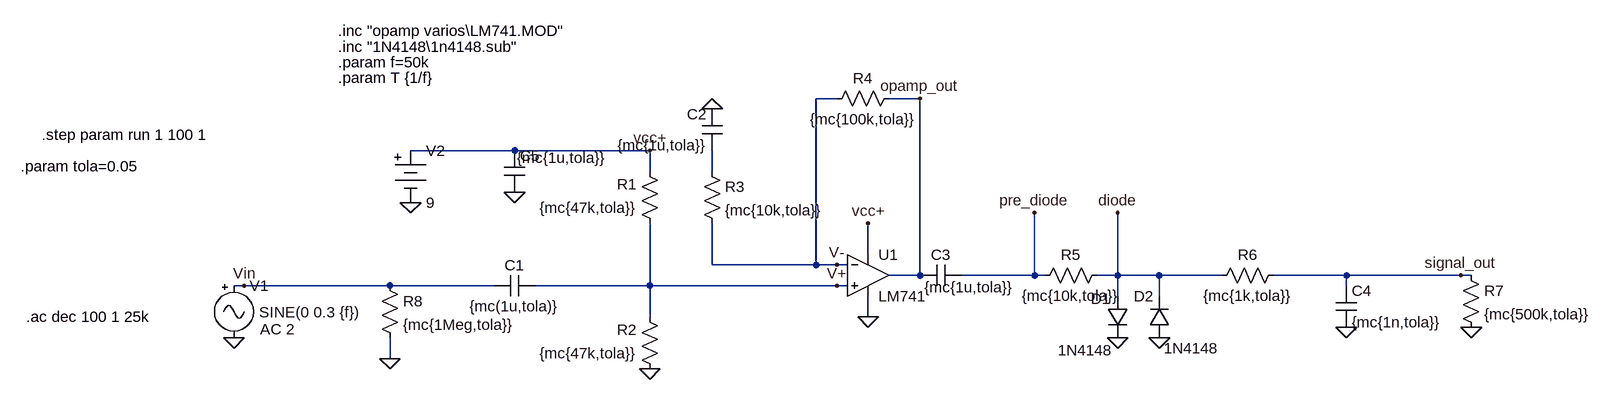
[diagram p0: schematic punto 5 montecarlo.asc]
punto 5 montecarlo.asc, the LTspice schematic file:
Version 4
SHEET 1 1692 680
WIRE 208 -160 176 -160
WIRE 336 -160 288 -160
WIRE -288 -80 -448 -80
WIRE -80 -80 -288 -80
WIRE -80 -48 -80 -80
WIRE 16 -48 16 -80
WIRE 256 80 256 32
WIRE 16 96 16 32
WIRE 176 96 176 -160
WIRE 176 96 16 96
WIRE 208 96 176 96
WIRE 224 96 208 96
WIRE 336 112 336 -160
WIRE 336 112 288 112
WIRE 512 112 512 16
WIRE 512 112 400 112
WIRE 528 112 512 112
WIRE 640 112 640 16
WIRE 640 112 608 112
WIRE 704 112 640 112
WIRE 800 112 704 112
WIRE 992 112 880 112
WIRE 1168 112 992 112
WIRE 1184 112 1168 112
WIRE -704 128 -720 128
WIRE -480 128 -704 128
WIRE -320 128 -480 128
WIRE -80 128 -80 32
WIRE -80 128 -256 128
WIRE 208 128 -80 128
WIRE 224 128 208 128
WIRE 992 128 992 112
WIRE 640 144 640 112
WIRE 704 144 704 112
WIRE -80 176 -80 128
WIRE 256 176 256 144
WIRE -480 240 -480 208
FLAG 208 128 V+
FLAG 208 96 V-
FLAG 16 -144 0
FLAG 640 208 0
FLAG 704 208 0
FLAG 992 192 0
FLAG 256 176 0
FLAG -80 256 0
FLAG 1184 192 0
FLAG -288 -16 0
FLAG -480 240 0
FLAG -720 208 0
FLAG -448 0 0
FLAG 1168 112 signal_out
FLAG -704 128 Vin
FLAG -80 -80 vcc+
FLAG 256 32 vcc+
FLAG 336 -160 opamp_out
FLAG 640 16 diode
FLAG 512 16 pre_diode
DATAFLAG -224 -80 ""
DATAFLAG -80 112 ""
SYMBOL res -64 48 R180
WINDOW 0 36 76 Left 2
WINDOW 3 36 40 Left 2
SYMATTR InstName R1
SYMATTR Value {mc{47k,tola}}
SYMBOL res -64 272 R180
WINDOW 0 36 76 Left 2
WINDOW 3 36 40 Left 2
SYMATTR InstName R2
SYMATTR Value {mc{47k,tola}}
SYMBOL res 0 -64 R0
SYMATTR InstName R3
SYMATTR Value {mc{10k,tola}}
SYMBOL res 304 -176 R90
WINDOW 0 0 56 VBottom 2
WINDOW 3 32 56 VTop 2
SYMATTR InstName R4
SYMATTR Value {mc{100k,tola}}
SYMBOL res 624 96 R90
WINDOW 0 0 56 VBottom 2
WINDOW 3 32 56 VTop 2
SYMATTR InstName R5
SYMATTR Value {mc{10k,tola}}
SYMBOL cap -256 112 R90
WINDOW 0 0 32 VBottom 2
WINDOW 3 32 32 VTop 2
SYMATTR InstName C1
SYMATTR Value {mc(1u,tola)}
SYMBOL cap 32 -80 R180
WINDOW 0 24 56 Left 2
WINDOW 3 24 8 Left 2
SYMATTR InstName C2
SYMATTR Value {mc{1u,tola}}
SYMBOL cap 336 128 R270
WINDOW 0 32 32 VTop 2
WINDOW 3 13 76 VBottom 2
SYMATTR InstName C3
SYMATTR Value {mc{1u,tola}}
SYMBOL res 896 96 R90
WINDOW 0 0 56 VBottom 2
WINDOW 3 32 56 VTop 2
SYMATTR InstName R6
SYMATTR Value {mc{1k,tola}}
SYMBOL cap 976 128 R0
SYMATTR InstName C4
SYMATTR Value {mc{1n,tola}}
SYMBOL diode 624 144 R0
WINDOW 0 -25 4 Left 2
WINDOW 3 87 80 Left 2
SYMATTR InstName D1
SYMATTR Value 1N4148
SYMBOL diode 720 208 R180
WINDOW 0 24 64 Left 2
WINDOW 3 87 -19 Left 2
SYMATTR InstName D2
SYMATTR Value 1N4148
SYMBOL res 1168 96 R0
SYMATTR InstName R7
SYMATTR Value {mc{500k,tola}}
SYMBOL res -496 112 R0
SYMATTR InstName R8
SYMATTR Value {mc{1Meg,tola}}
SYMBOL cap -304 -80 R0
WINDOW 3 20 11 Left 2
SYMATTR Value {mc{1u,tola}}
SYMATTR InstName C5
SYMBOL Misc\\battery -448 -96 R0
WINDOW 123 0 0 Left 2
WINDOW 39 0 0 Left 2
SYMATTR InstName V2
SYMATTR Value 9
SYMBOL Misc\\signal -720 112 R0
WINDOW 123 40 83 Left 2
WINDOW 39 0 0 Left 2
WINDOW 3 39 57 Left 2
SYMATTR Value2 AC 2
SYMATTR Value SINE(0 0.3 {f})
SYMATTR InstName V1
SYMBOL Opamps\\opamp2 256 48 R0
SYMATTR InstName U1
SYMATTR Value LM741
TEXT -560 -264 Left 2 !.inc "opamp varios\\LM741.MOD"
TEXT -560 -240 Left 2 !.inc "1N4148\\1n4148.sub"
TEXT -560 -216 Left 2 !.param f=50k
TEXT -560 -192 Left 2 !.param T {1/f}
TEXT -1048 -56 Left 2 !.param tola=0.05
TEXT -1016 -104 Left 2 !.step param run 1 100 1
TEXT -1040 176 Left 2 !.ac dec 100 1 25k

The netlist it stands for:
* punto 5 montecarlo.asc
R1 V+ vcc+ {mc{47k,tola}}
R2 0 V+ {mc{47k,tola}}
R3 N001 V- {mc{10k,tola}}
R4 opamp_out V- {mc{100k,tola}}
R5 diode pre_diode {mc{10k,tola}}
C1 V+ Vin {mc(1u,tola)}
C2 N001 0 {mc{1u,tola}}
C3 opamp_out pre_diode {mc{1u,tola}}
R6 signal_out diode {mc{1k,tola}}
C4 signal_out 0 {mc{1n,tola}}
D1 diode 0 1N4148
D2 0 diode 1N4148
R7 signal_out 0 {mc{500k,tola}}
R8 Vin 0 {mc{1Meg,tola}}
C5 vcc+ 0 {mc{1u,tola}}
V2 vcc+ 0 9
V1 Vin 0 SINE(0 0.3 {f}) AC 2
XU1 V+ V- vcc+ 0 opamp_out LM741  ; pins In+ In- V+ V- OUT
.model D D
.lib standard.dio
.inc "opamp varios\LM741.MOD"
.inc "1N4148\1n4148.sub"
.param f=50k
.param T {1/f}
.param tola=0.05
.step param run 1 100 1
.ac dec 100 1 25k
.backanno
.end